# Altium schematic sheet power-vtt.SchDoc: Copper Suicide - VTT Power
size Letter; CheckedBy: J. Brinton; CompanyName: Signal Laboratories, Inc.; DrawnBy: J. Brinton; Engineer: J. Brinton; Address1: 3479 Edison Way; Address2: Menlo Park CA 94025; Address3: +1 (877) 778-8435; Address4: siglabs.com; Revision: 3; SheetNumber: 45; SheetTotal: 47
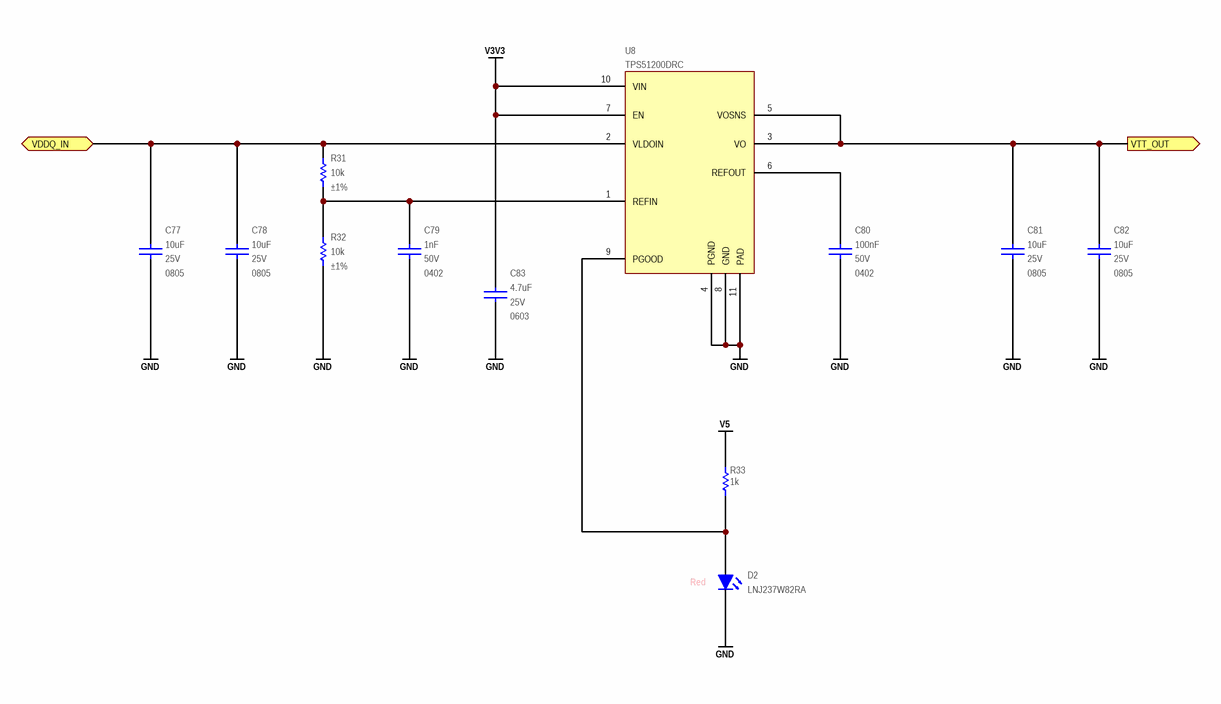
[diagram p0: power-vtt.SchDoc]

## Parts
C77  value 10uF  Voltage: 25V  Package: 0805  [CAPC200X125X145L45N]  (hidden comment: GRM21BC81E106KE51)
C78  value 10uF  Voltage: 25V  Package: 0805  [CAPC200X125X145L45N]  (hidden comment: GRM21BC81E106KE51)
C79  value 1nF  Voltage: 50V  Package: 0402  [CAPC100X50X55L25N]  (hidden comment: GRM155R71H102KA01)
C80  value 100nF  Voltage: 50V  Package: 0402  [CAPC100X50X55L25N]  (hidden comment: GCM155R71H104KE02)
C81  value 10uF  Voltage: 25V  Package: 0805  [CAPC200X125X145L45N]  (hidden comment: GRM21BC81E106KE51)
C82  value 10uF  Voltage: 25V  Package: 0805  [CAPC200X125X145L45N]  (hidden comment: GRM21BC81E106KE51)
C83  value 4.7uF  Voltage: 25V  Package: 0603  [CAPC160X80X90L20N]  (hidden comment: GRM188R61E475KE11)
D2  LNJ237W82RA  [0603_LED]
R31  value 10k  Tolerance: ±1%  [RESC1005X40N]  (hidden comment: ERJ-2RKF1002X)
R32  value 10k  Tolerance: ±1%  [RESC1005X40N]  (hidden comment: ERJ-2RKF1002X)
R33  value 1k  [RESC1005X40N]  (hidden comment: ERJ-2RKF1001X)
U8  TPS51200DRC  [DRC]

## Ports
VDDQ_IN, VTT_OUT (out)

## Nets
GND: C77.1 C78.1 C79.2 C80.1 C81.1 C82.1 C83.1 D2.2(K) R32.2 U8.4(PGND) U8.8(GND) U8.11(PAD)
V3V3: C83.2 U8.7(EN) U8.10(VIN)
V5: R33.2
VDDQ_IN: C77.2 C78.2 R31.1 U8.2(VLDOIN) ; port VDDQ_IN
VTT_OUT: C81.2 C82.2 U8.3(VO) U8.5(VOSNS) ; port VTT_OUT
NetC79_1: C79.1 R31.2 R32.1 U8.1(REFIN)
NetC80_2: C80.2 U8.6(REFOUT)
NetD2_1: D2.1(A) R33.1 U8.9(PGOOD)

## Notes on the sheet
- (near D2) Red
- Title
- Engineer
- Revision
- Drawn By
- Checked By
- Date
- Sheet
- of

## Library data of the parts
C77 C78 C81 C82 = CAP: Ceramic Capacitor 10uF ±10% 25V X6S 0805; Manufacturer: Murata; Tr: -55:105; Manufacturer P/N: GRM21BC81E106KE51; Tolerance: ±10%
C79 = CAP: Ceramic Capacitor 1nF ±10% 50V X7R 0402; Manufacturer: Murata; Tr: -55:125; Manufacturer P/N: GRM155R71H102KA01; Tolerance: ±10%
C80 = CAP: Ceramic Capacitor 100nF ±10% 50V X7R 0402; Manufacturer: Murata; Tr: -55:125; Manufacturer P/N: GCM155R71H104KE02; Tolerance: ±10%; Footprint: *
C83 = CAP 0603: Ceramic Capacitor 4.7uF ±10% 25V X5R 0603; Manufacturer: Murata; Tr: -55:85; Manufacturer P/N: GRM188R61E475KE11; Tolerance: ±10%
D2 = LED0603RD: LED, SMT 0603, Color Red, 5mA, 1.85V; Manufacturer: Panasonic; Manufacturer P/N: LNJ237W82RA; Package: 0603 Polarized
R31 R32 = RES: Thick Film Resistor 10k ±1% 0.1W 50V 0402; Manufacturer: Panasonic; Tcr: ±100; Tr: -55:155; Voltage: 50; Power: 0.1; Manufacturer P/N: ERJ-2RKF1002X; Alternatives: *; Footprint: *; Package: 0402
R33 = RES: Thick Film Resistor 1k ±1% 0.1W 50V 0402; Manufacturer: Panasonic; Tcr: ±100; Tr: -55:155; Voltage: 50; Power: 0.1; Manufacturer P/N: ERJ-2RKF1001X; Tolerance: ±1%; Alternatives: *; Footprint: *; Package: 0402
U8 = TPS51200: DDR Termination Regulator, 3A Sink and Source; Manufacturer: Texas Instruments; Manufacturer P/N: TPS51200DRC